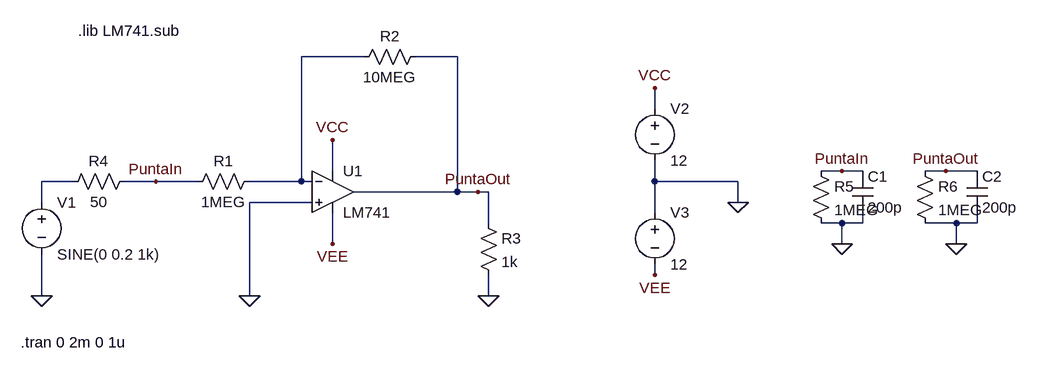
[diagram p0: schematic A1B.asc]
A1B.asc, the LTspice schematic file:
Version 4
SHEET 1 1192 680
WIRE 176 16 80 16
WIRE 320 16 256 16
WIRE 624 96 624 64
WIRE 128 192 128 144
WIRE 912 192 880 192
WIRE 944 192 912 192
WIRE 1072 192 1040 192
WIRE 1120 192 1072 192
WIRE -272 208 -320 208
WIRE -144 208 -192 208
WIRE -80 208 -144 208
WIRE 80 208 80 16
WIRE 80 208 0 208
WIRE 96 208 80 208
WIRE 624 208 624 176
WIRE 752 208 624 208
WIRE 320 224 320 16
WIRE 320 224 160 224
WIRE 352 224 320 224
WIRE 368 224 352 224
WIRE -320 240 -320 208
WIRE 96 240 0 240
WIRE 752 240 752 208
WIRE 624 256 624 208
WIRE 368 272 368 224
WIRE 912 272 880 272
WIRE 944 272 944 256
WIRE 944 272 912 272
WIRE 1088 272 1040 272
WIRE 1120 272 1120 256
WIRE 1120 272 1088 272
WIRE 128 304 128 256
WIRE 912 304 912 272
WIRE 1088 304 1088 272
WIRE 624 352 624 336
WIRE -320 384 -320 320
WIRE 0 384 0 240
WIRE 368 384 368 352
FLAG 0 384 0
FLAG -320 384 0
FLAG 368 384 0
FLAG 752 240 0
FLAG 624 64 VCC
FLAG 624 352 VEE
FLAG 128 144 VCC
FLAG 128 304 VEE
FLAG 912 304 0
FLAG 1088 304 0
FLAG 912 192 PuntaIn
FLAG -144 208 PuntaIn
FLAG 1072 192 PuntaOut
FLAG 352 224 PuntaOut
SYMBOL Opamps\\opamp2 128 160 R0
SYMATTR InstName U1
SYMATTR Value LM741
SYMBOL res 16 192 R90
WINDOW 0 0 56 VBottom 2
WINDOW 3 32 56 VTop 2
SYMATTR InstName R1
SYMATTR Value 1MEG
SYMBOL res 272 0 R90
WINDOW 0 0 56 VBottom 2
WINDOW 3 32 56 VTop 2
SYMATTR InstName R2
SYMATTR Value 10MEG
SYMBOL voltage -320 224 R0
WINDOW 123 0 0 Left 2
WINDOW 39 0 0 Left 2
SYMATTR InstName V1
SYMATTR Value SINE(0 0.2 1k)
SYMBOL res 352 256 R0
SYMATTR InstName R3
SYMATTR Value 1k
SYMBOL voltage 624 240 R0
SYMATTR InstName V3
SYMATTR Value 12
SYMBOL voltage 624 80 R0
SYMATTR InstName V2
SYMATTR Value 12
SYMBOL res -176 192 R90
WINDOW 0 0 56 VBottom 2
WINDOW 3 32 56 VTop 2
SYMATTR InstName R4
SYMATTR Value 50
SYMBOL res 864 176 R0
SYMATTR InstName R5
SYMATTR Value 1MEG
SYMBOL cap 928 192 R0
SYMATTR InstName C1
SYMATTR Value 200p
SYMBOL res 1024 176 R0
SYMATTR InstName R6
SYMATTR Value 1MEG
SYMBOL cap 1104 192 R0
SYMATTR InstName C2
SYMATTR Value 200p
TEXT -264 -24 Left 2 !.lib LM741.sub
TEXT -352 456 Left 2 !.tran 0 2m 0 1u

The netlist it stands for:
* A1B.asc
XU1 0 N001 VCC VEE PuntaOut LM741  ; pins In+ In- V+ V- OUT
R1 N001 PuntaIn 1MEG
R2 PuntaOut N001 10MEG
V1 N002 0 SINE(0 0.2 1k)
R3 PuntaOut 0 1k
V3 0 VEE 12
V2 VCC 0 12
R4 PuntaIn N002 50
R5 PuntaIn 0 1MEG
C1 PuntaIn 0 200p
R6 PuntaOut 0 1MEG
C2 PuntaOut 0 200p
.lib LM741.sub
.tran 0 2m 0 1u
.backanno
.end